# EAGLE schematic VoltageDivider (EAGLE 7.2.0)
CNAME: Voltage divider constructions; CREVISION: 1.0; DESIGNER: S.j.de.Bakker@hr.nl
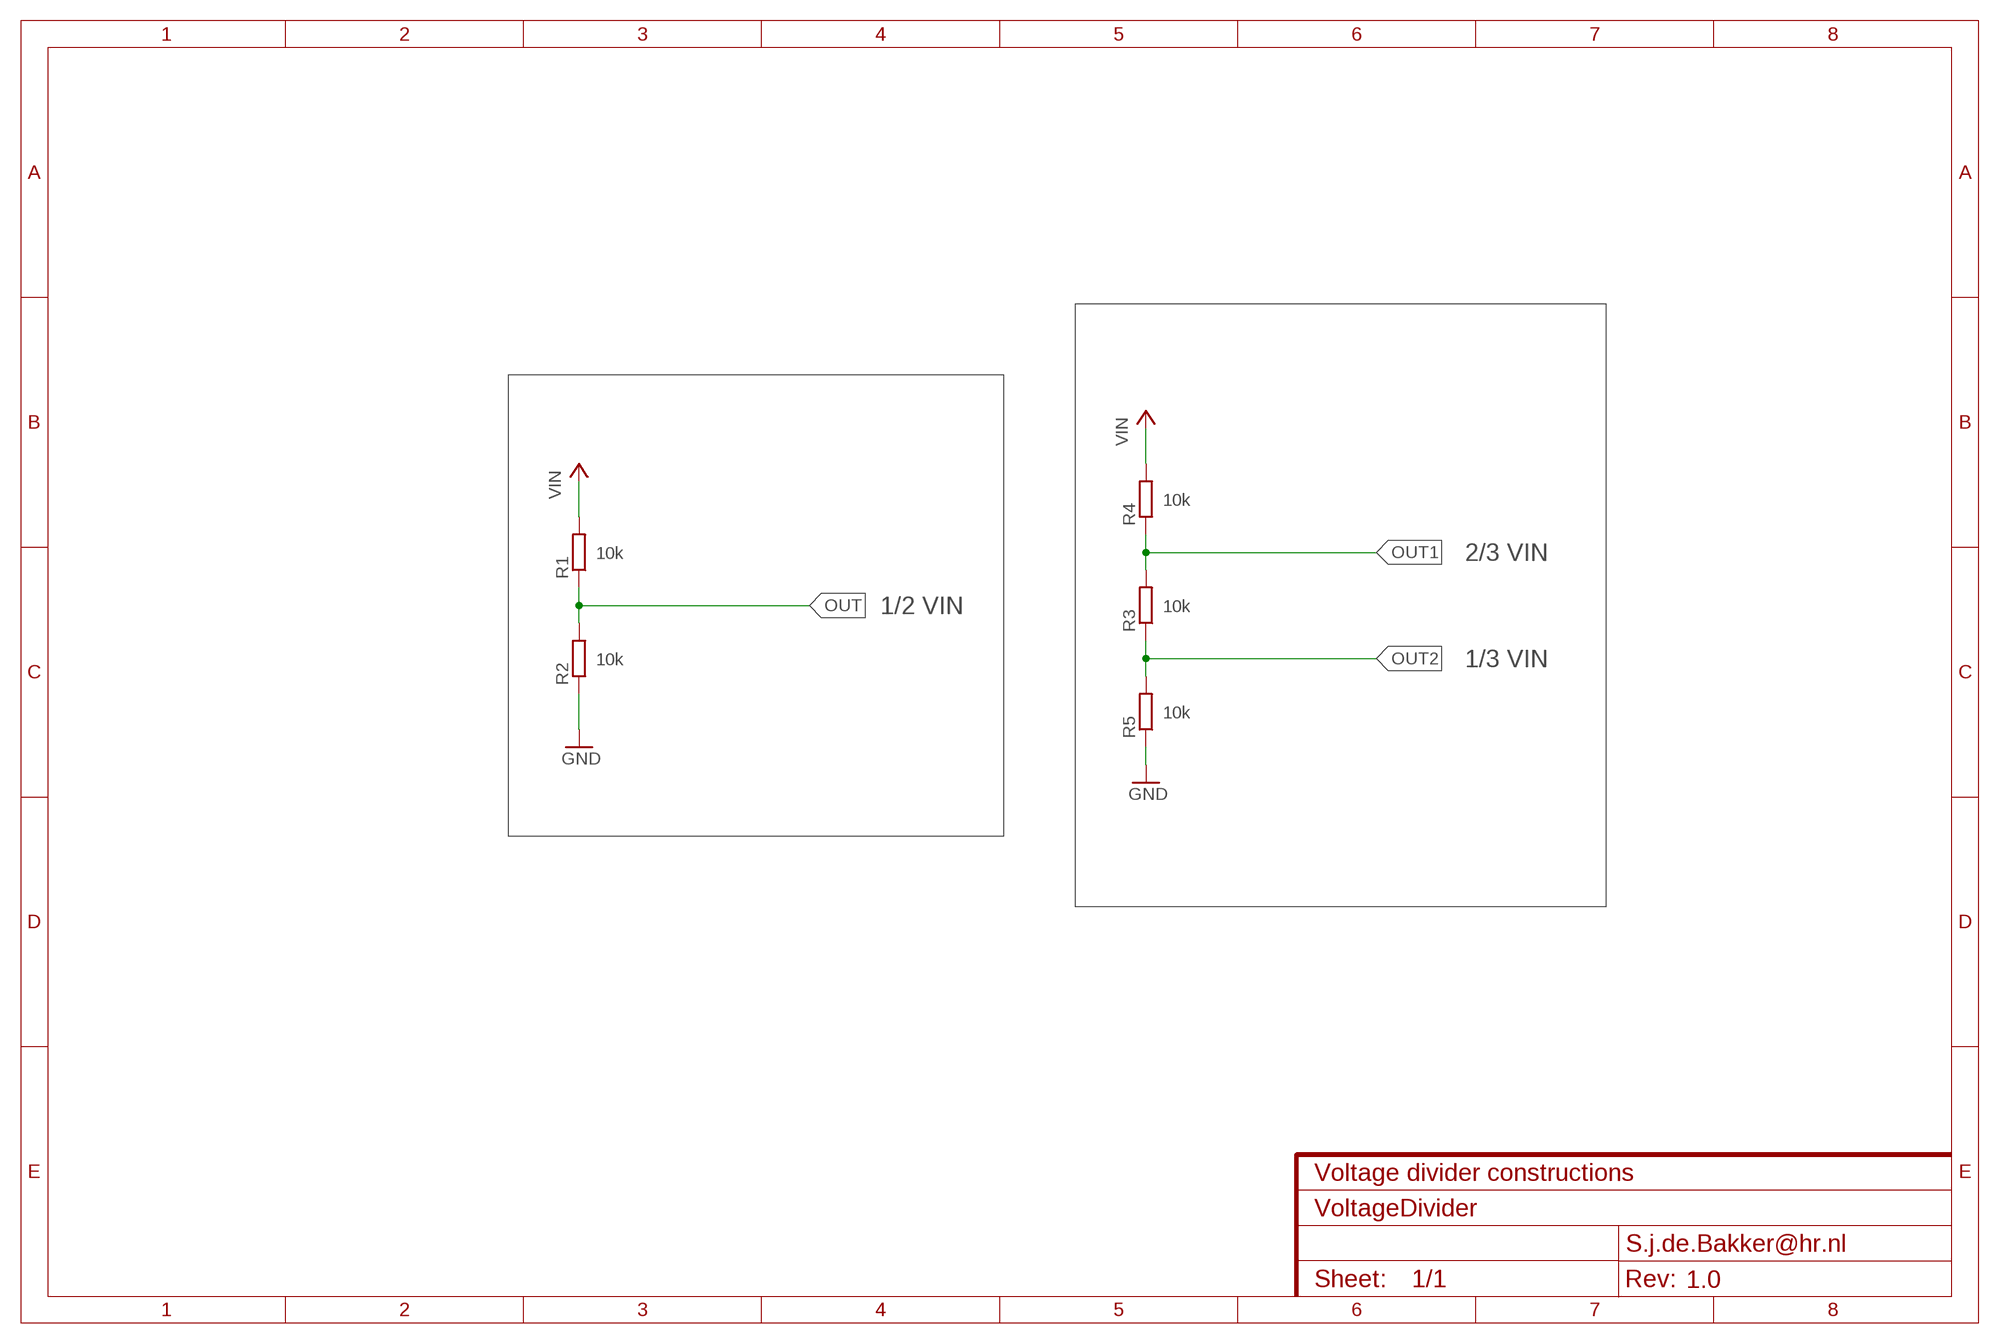
[diagram p0: schematic, sheet 1]

## Parts
R1  10k  R-EU_VTA52  [VTA52]
R2  10k  R-EU_VTA52  [VTA52]
R3  10k  R-EU_VTA52  [VTA52]
R4  10k  R-EU_VTA52  [VTA52]
R5  10k  R-EU_VTA52  [VTA52]

## Nets
+5V: R1.2 R4.2 ; supply symbol labelled VIN
GND: R2.1 R5.1
OUT: R1.1 R2.2
OUT1: R3.2 R4.1
OUT2: R3.1 R5.2

## Notes on the sheet
- 2/3 VIN
- 1/2 VIN
- 1/3 VIN

## Library data of the parts
R1-R5 = rcl:R-EU_: RESISTOR, European symbol